# Altium schematic sheet 48-17V Buck Converter.SchDoc: 48-17V Buck Converter
size B; CheckedBy: Logan Hartford; Engineer: Rayyan Mahmood; Organization: UW Robotics; Address1: 200 University Avenue; Address2: Waterloo; Address3: Ontario; Address4: Canada N2L 3G6; DocumentNumber: 1; Revision: 1.0; SheetNumber: 1; SheetTotal: 1
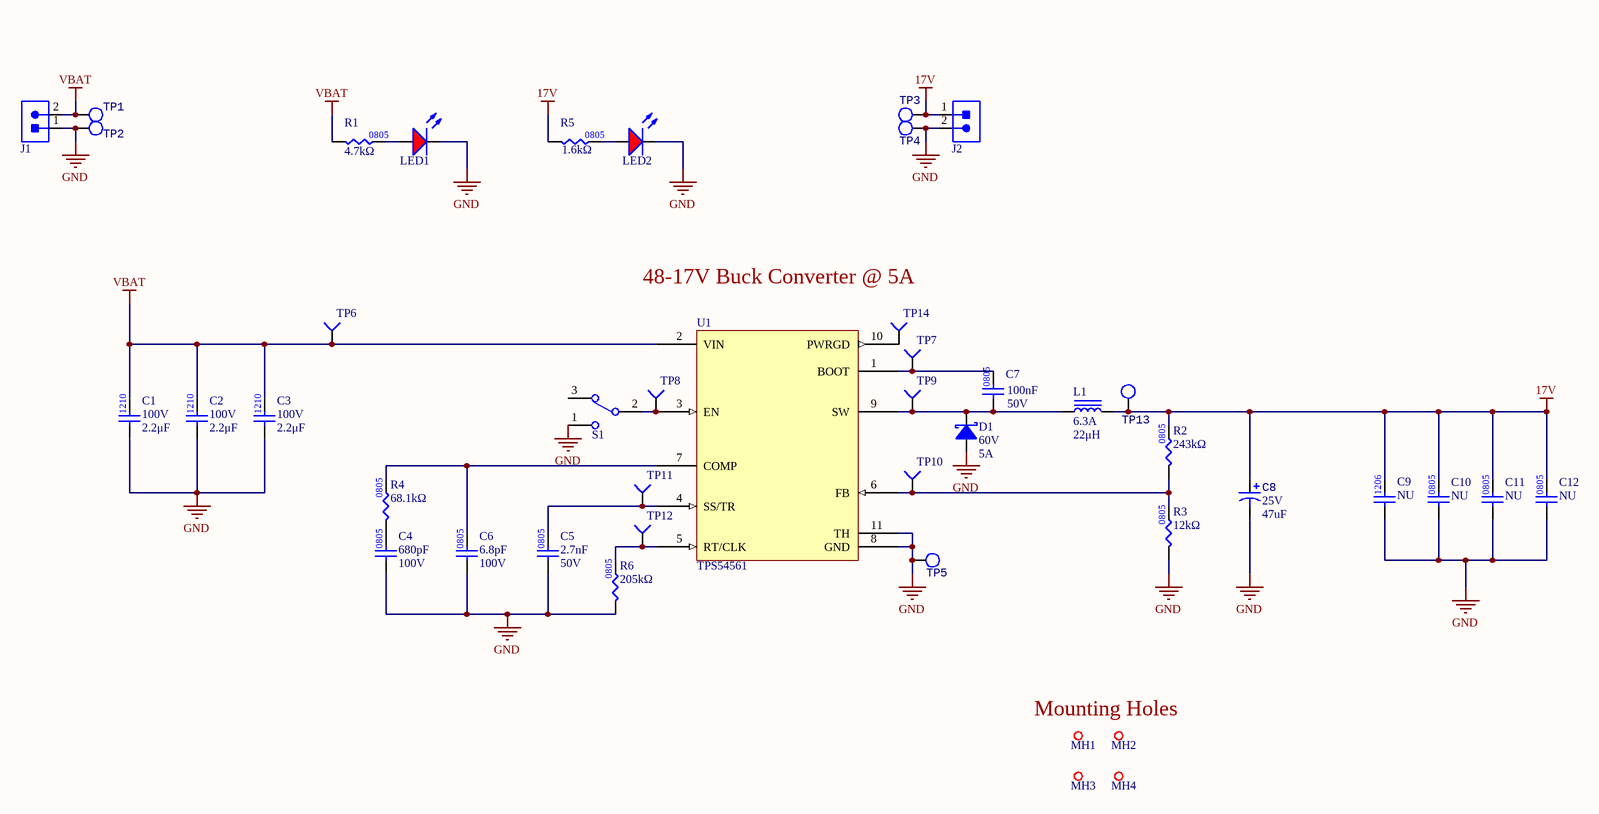
[diagram p0: 48-17V Buck Converter.SchDoc]

## Parts
C1  value 2.2μF  Voltage Rating: 100V  [CAPC3225X270N]  (hidden comment: CAP_2.2uF_100V_1210_1)
C2  value 2.2μF  Voltage Rating: 100V  [CAPC3225X270N]  (hidden comment: CAP_2.2uF_100V_1210_1)
C3  value 2.2μF  Voltage Rating: 100V  [CAPC3225X270N]  (hidden comment: CAP_2.2uF_100V_1210_1)
C4  value 680pF  Voltage Rating: 100V  [CAP0805]  (hidden comment: CAP_680pF_50V_0805)
C5  value 2.7nF  Voltage Rating: 50V  [CAP0805]  (hidden comment: CAP_2.7nF_50V_0805)
C6  value 6.8pF  Voltage Rating: 100V  [CAP0805]  (hidden comment: CAP_6.8pF_100V_0805)
C7  value 100nF  Voltage Rating: 50V  [CAP0805]  (hidden comment: CAP_100nF_50V_0805)
C8  value 47uF  Voltage: 25V  [CAP_47uF_25V_ALUM]  (hidden comment: CAP_47uF_25V_ALUM)
C9  value NU  [CAP1206]  (hidden comment: CAP_NU_1206)
C10  value NU  [CAP0805]  (hidden comment: CAP_NU_0805)
C11  value NU  [CAP0805]  (hidden comment: CAP_NU_0805)
C12  value NU  [CAP0805]  (hidden comment: CAP_NU_0805)
D1  Vr (Max): 60V  Io: 5A  [SOD-323_UNIDIR]  (hidden comment: DIO_SCHOTTKY_30V_800mA)
J1  CON_2POS_SCREW_TERM  [1935161]  (value not drawn)
J2  CON_2POS_SCREW_TERM  [1935161]  (value not drawn)
L1  Current Rating: 6.3A  Inductance: 22μH  [IND_22uH_6.3A]  (hidden comment: IND_22uH_6.3A)
LED1  LED_RED  [LED_0805_RED]  (value not drawn)
LED2  LED_RED  [LED_0805_RED]  (value not drawn)
MH1  MOUNTING_HOLE_M3_GIMBAL_REV2  [MOUNTING_HOLE_3mm_GIMBAL_REV2]  (value not drawn)  (no BOM)
MH2  MOUNTING_HOLE_M3_GIMBAL_REV2  [MOUNTING_HOLE_3mm_GIMBAL_REV2]  (value not drawn)  (no BOM)
MH3  MOUNTING_HOLE_M3_GIMBAL_REV2  [MOUNTING_HOLE_3mm_GIMBAL_REV2]  (value not drawn)  (no BOM)
MH4  MOUNTING_HOLE_M3_GIMBAL_REV2  [MOUNTING_HOLE_3mm_GIMBAL_REV2]  (value not drawn)  (no BOM)
R1  value 4.7kΩ  [RES0805]  (hidden comment: RES_4.7kΩ_0805_5%)
R2  value 243kΩ  [RES0805]  (hidden comment: RES_243kΩ_0805_1%_1)
R3  value 12kΩ  [RES0805]  (hidden comment: RES_12kΩ_0805_1%)
R4  value 68.1kΩ  [RES0805]  (hidden comment: RES_68.1kΩ_0805_1%)
R5  value 1.6kΩ  [RES0805]  (hidden comment: RES_1.6kΩ_0805_0.1%)
R6  value 205kΩ  [RES0805]  (hidden comment: RES_205kΩ_0805_1%)
S1  SW_SLIDE_TOGGLE  [SW_SLIDE_TOGGLE]  (value not drawn)
TP1  TESTPOINT_LOOP  [TESTPOINT_LOOP]  (value not drawn)
TP2  TESTPOINT_LOOP  [TESTPOINT_LOOP]  (value not drawn)
TP3  TESTPOINT_LOOP  [TESTPOINT_LOOP]  (value not drawn)
TP4  TESTPOINT_LOOP  [TESTPOINT_LOOP]  (value not drawn)
TP5  TESTPOINT_LOOP  [TESTPOINT_LOOP]  (value not drawn)
TP6  TESTPOINT_1MM_CIRCLE  [TESTPOINT_CIRCLE_1MM]  (value not drawn)  (no BOM)
TP7  TESTPOINT_1MM_CIRCLE  [TESTPOINT_CIRCLE_1MM]  (value not drawn)  (no BOM)
TP8  TESTPOINT_1MM_CIRCLE  [TESTPOINT_CIRCLE_1MM]  (value not drawn)  (no BOM)
TP9  TESTPOINT_1MM_CIRCLE  [TESTPOINT_CIRCLE_1MM]  (value not drawn)  (no BOM)
TP10  TESTPOINT_1MM_CIRCLE  [TESTPOINT_CIRCLE_1MM]  (value not drawn)  (no BOM)
TP11  TESTPOINT_1MM_CIRCLE  [TESTPOINT_CIRCLE_1MM]  (value not drawn)  (no BOM)
TP12  TESTPOINT_1MM_CIRCLE  [TESTPOINT_CIRCLE_1MM]  (value not drawn)  (no BOM)
TP13  TESTPOINT_LOOP  [TESTPOINT_LOOP]  (value not drawn)
TP14  TESTPOINT_1MM_CIRCLE  [TESTPOINT_CIRCLE_1MM]  (value not drawn)  (no BOM)
U1  TPS54561  [BUCK_TPS54561DPRR]

## Nets
17V: C8.1 C9.2 C10.2 C11.2 C12.2 J2.1 L1.2 R2.2 R5.1 TP3.1 TP13.1
GND: C1.1 C2.1 C3.1 C4.1 C5.1 C6.1 C8.2 C9.1 C10.1 C11.1 C12.1 D1.1(Anode) J1.1 J2.2 LED1.2(K) LED2.2(K) R3.1 R6.1 S1.1 TP2.1 TP4.1 TP5.1 U1.8(GND) U1.11(TH)
VBAT: C1.2 C2.2 C3.2 J1.2 R1.1 TP1.1 TP6.1(=value) U1.2(VIN)
NetC4_2: C4.2 R4.1
NetC5_2: C5.2 TP11.1(=value) U1.4(SS/TR)
NetC6_2: C6.2 R4.2 U1.7(COMP)
NetC7_1: C7.1 D1.2(Cathode) L1.1 TP9.1(=value) U1.9(SW)
NetC7_2: C7.2 TP7.1(=value) U1.1(BOOT)
NetLED1_1: LED1.1(A) R1.2
NetLED2_1: LED2.1(A) R5.2
NetR2_1: R2.1 R3.2 TP10.1(=value) U1.6(FB)
NetR6_2: R6.2 TP12.1(=value) U1.5(RT/CLK)
NetS1_2: S1.2 TP8.1(=value) U1.3(EN)
NetTP14_1: TP14.1(=value) U1.10(PWRGD)

Not connected (* = marked no-connect by the designer): S1 3

## Notes on the sheet
- I = V/R
  I = 51/4700
  I = 10.8
- I = V/R
  I = 17/1600
  I = 10.6
- 48-17V Buck Converter @ 5A
- (near U1) Double check footprint for this IC
- PWRGD needed ONLY if a 5.5V or lower voltage source is connected
- Mounting Holes
- Title:
- Project:
- Date:
- Rev:
- Reviewer:
- Engineer:
- Sheet:
- of
- (in symbol RES_1.6kΩ_0805_0.1%) 0805

## Library data of the parts
C1-C3 = CAP_2.2uF_100V_1210_1: CAP CER 2.2UF 100V X7R 1210; Manufacturer 1: TDK Corporation; Manufacturer Part Number 1: C3225X7R2A225K230AB; Package/Footprint: 1210; Supplier 1: Digi-Key; Supplier Part Number 1: 445-4497-1-ND; Mounting Type: SMD
C4 = CAP_680pF_50V_0805: CAP CER 680PF 100V C0G/NP0 0805; Manufacturer 1: KYOCERA AVX; Manufacturer Part Number 1: 08051A681JAT2A; Package/Footprint: 0805; Supplier 1: Digi-Key; Supplier Part Number 1: 478-1289-1-ND
C5 = CAP_2.7nF_50V_0805: CAP CER 2700PF 50V C0G 0805; Manufacturer 1: TDK Corporation; Manufacturer Part Number 1: C2012C0G1H272J060AA; Package/Footprint: 0805; Supplier 1: Digi-Key; Supplier Part Number 1: 445-7508-1-ND
C6 = CAP_6.8pF_100V_0805: CAP CER 6.8PF 100V C0G/NP0 0805; Manufacturer 1: KYOCERA AVX; Manufacturer Part Number 1: 08051A6R8CAT2A; Package/Footprint: 0805; Supplier 1: Digi-Key; Supplier Part Number 1: 478-5025-1-ND
C7 = CAP_100nF_50V_0805: CAP CER 0.1UF 50V X7R 0805; Manufacturer 1: Samsung Electro-Mechanics; Manufacturer Part Number 1: CL21B104KBCNNNC; Package/Footprint: 0805; Supplier 1: Digi-Key; Supplier Part Number 1: 1276-1003-1-ND
C8 = CAP_47uF_25V_ALUM: CAP ALUM POLY 47UF 20% 25V SMD; Manufacturer 1: Panasonic Electronic Components; Manufacturer Part Number 1: 25SVPF47M; Supplier 1: DigiKey; Supplier Part Number 1: P16513CT-ND; Mounting Type: SMD
C9 = CAP_NU_1206: PLACEHOLDER CAPACITOR; Mounting Type: Surface Mount; Package: 1206
C10-C12 = CAP_NU_0805: PLACEHOLDER CAPACITOR; Mounting Type: SMD; Package: 0805
D1 = DIO_SCHOTTKY_60V_5A: DIODE SCHOTTKY 60V 5A SMC; Manufacturer 1: Diodes Incorporated; Manufacturer Part Number 1: B560C-13-F; Vf (Max): 700mV; Supplier 1: Digi-Key; Supplier Part Number 1: B560C-FDICT-ND; Mounting Type: SMD
J1 J2 = CON_2POS_SCREW_TERM: TERM BLK 2POS SIDE ENTRY 5MM; Manufacturer 1: Phoenix Contact; Package/Footprint: SMD; Supplier 1: Digi-Key; Mounting Type: TH; Supplier Part Number 1: 277-1667-ND; Manufacturer Part Number 1: 1935161
L1 = IND_22uH_6.3A: FIXED IND 22UH 6.3A 25.7MOHM SMD; Manufacturer 1: Eaton - Electronics Division; Manufacturer Part Number 1: HC9-220-R; DC Resistance (DCR): 22.27mR; Inductance Tolerance: 20%; Saturation Current: 11A; Supplier 1: Digi-Key; Supplier Part Number 1: 513-1349-1-ND; Mounting Type: SMD
LED1 LED2 = LED_RED: LED RED DIFFUSED 0805 SMD; Manufacturer 1: OSRAM; Manufacturer Part Number 1: LS R976-NR-1; Package/Footprint: 0805; Forward Voltage Drop: 2V; Supplier Part Number 1: 475-1278-1-ND; Supplier 1: Digi-Key; Mounting Type: SMD
MH1-MH4 = MOUNTING_HOLE_M3_GIMBAL_REV2: MOUNTING_HOLE_M3 Gimbal Rev2
R1 = RES_4.7kΩ_0805_5%: RES 4.7K OHM 5% 1/8W 0805; Manufacturer 1: Yageo; Manufacturer Part Number 1: RC0805JR-074K7L; Supplier 1: Digi-Key; Supplier Part Number 1: 311-4.7KARCT-ND; Mounting Type: SMD; LCSC Part #: C17673; Package: 0805
R2 = RES_243kΩ_0805_1%_1: RES 243K OHM 1% 1/8W 0805; Manufacturer 1: YAGEO; Manufacturer Part Number 1: RC0805FR-07243KL; Package/Footprint: 0805; Supplier Part Number 1: 311-243KCRCT-ND; Supplier 1: Digi-Key; Mounting Type: SMD
R3 = RES_12kΩ_0805_1%: RES 12K OHM 1% 1/8W 0805; Manufacturer 1: YAGEO; Manufacturer Part Number 1: RC0805FR-0712KL; Package/Footprint: 0805; Supplier Part Number 1: 311-12.0KCRCT-ND; Supplier 1: Digi-Key; Mounting Type: SMD
R4 = RES_68.1kΩ_0805_1%: RES 68.1K OHM 1% 1/8W 0805; Manufacturer 1: YAGEO; Manufacturer Part Number 1: RC0805FR-0768K1L; Package/Footprint: 0805; Supplier Part Number 1: 311-68.1KCRCT-ND; Supplier 1: Digi-Key; Mounting Type: SMD
R5 = RES_1.6kΩ_0805_0.1%: RES 1.6K OHM 0.1% 1/4W 0805; Manufacturer 1: Panasonic; Manufacturer Part Number 1: ERJ-PB6B1601V; Supplier 1: Digi-Key; Supplier Part Number 1: P20615CT-ND; Mounting Type: SMD; Tolerance: 0.1%
R6 = RES_205kΩ_0805_1%: RES 205K OHM 1% 1/8W 0805; Manufacturer 1: YAGEO; Manufacturer Part Number 1: RC0805FR-07205KL; Package/Footprint: 0805; Supplier Part Number 1: 311-205KCRCT-ND; Supplier 1: Digi-Key; Mounting Type: SMD
S1 = SW_SLIDE_TOGGLE: SWITCH SLIDE SPDT 200MA 30V; Manufacturer 1: E-Switch; Manufacturer Part Number 1: 100SP1T1B4M2QE; Package/Footprint: TH; Supplier 1: Digi-Key; Mounting Type: TH; Voltage Rating (DC): 30V; Throw Configuration: SPDT; Supplier Part Number 1: EG1903-ND
TP1-TP5 TP13 = TESTPOINT_LOOP: TESTPOINT THRUHOLE; Manufacturer 1: Keystone Electronics; Manufacturer Part Number 1: 5002; Package/Footprint: TH; Supplier Part Number 1: 36-5002-ND; Supplier 1: Digi-Key; Mounting Type: TH
TP6-TP12 TP14 = TESTPOINT_1MM_CIRCLE: TESTPOINT 1MM CIRCLE
U1 = TPS54561: Buck Switching Regulator IC Positive Adjustable 0.8V 1 Output 5A 10-WDFN Exposed Pad; Manufacturer 1: Texas Instruments; Manufacturer Part Number 1: TPS54561DPRR; Supplier 1: Digi-Key; Supplier Part Number 1: 296-40803-1-ND; Package/Footprint: 10-WDFN Exposed Pad; Mounting Type: SMD